# EasyEDA schematic PCB_Schaltplan.json
TITLE: Sheet_1; REV: 1.0; Date: 2023-08-25; Sheet: 1/1; Drawn By: lucaskri; Company: Your Company
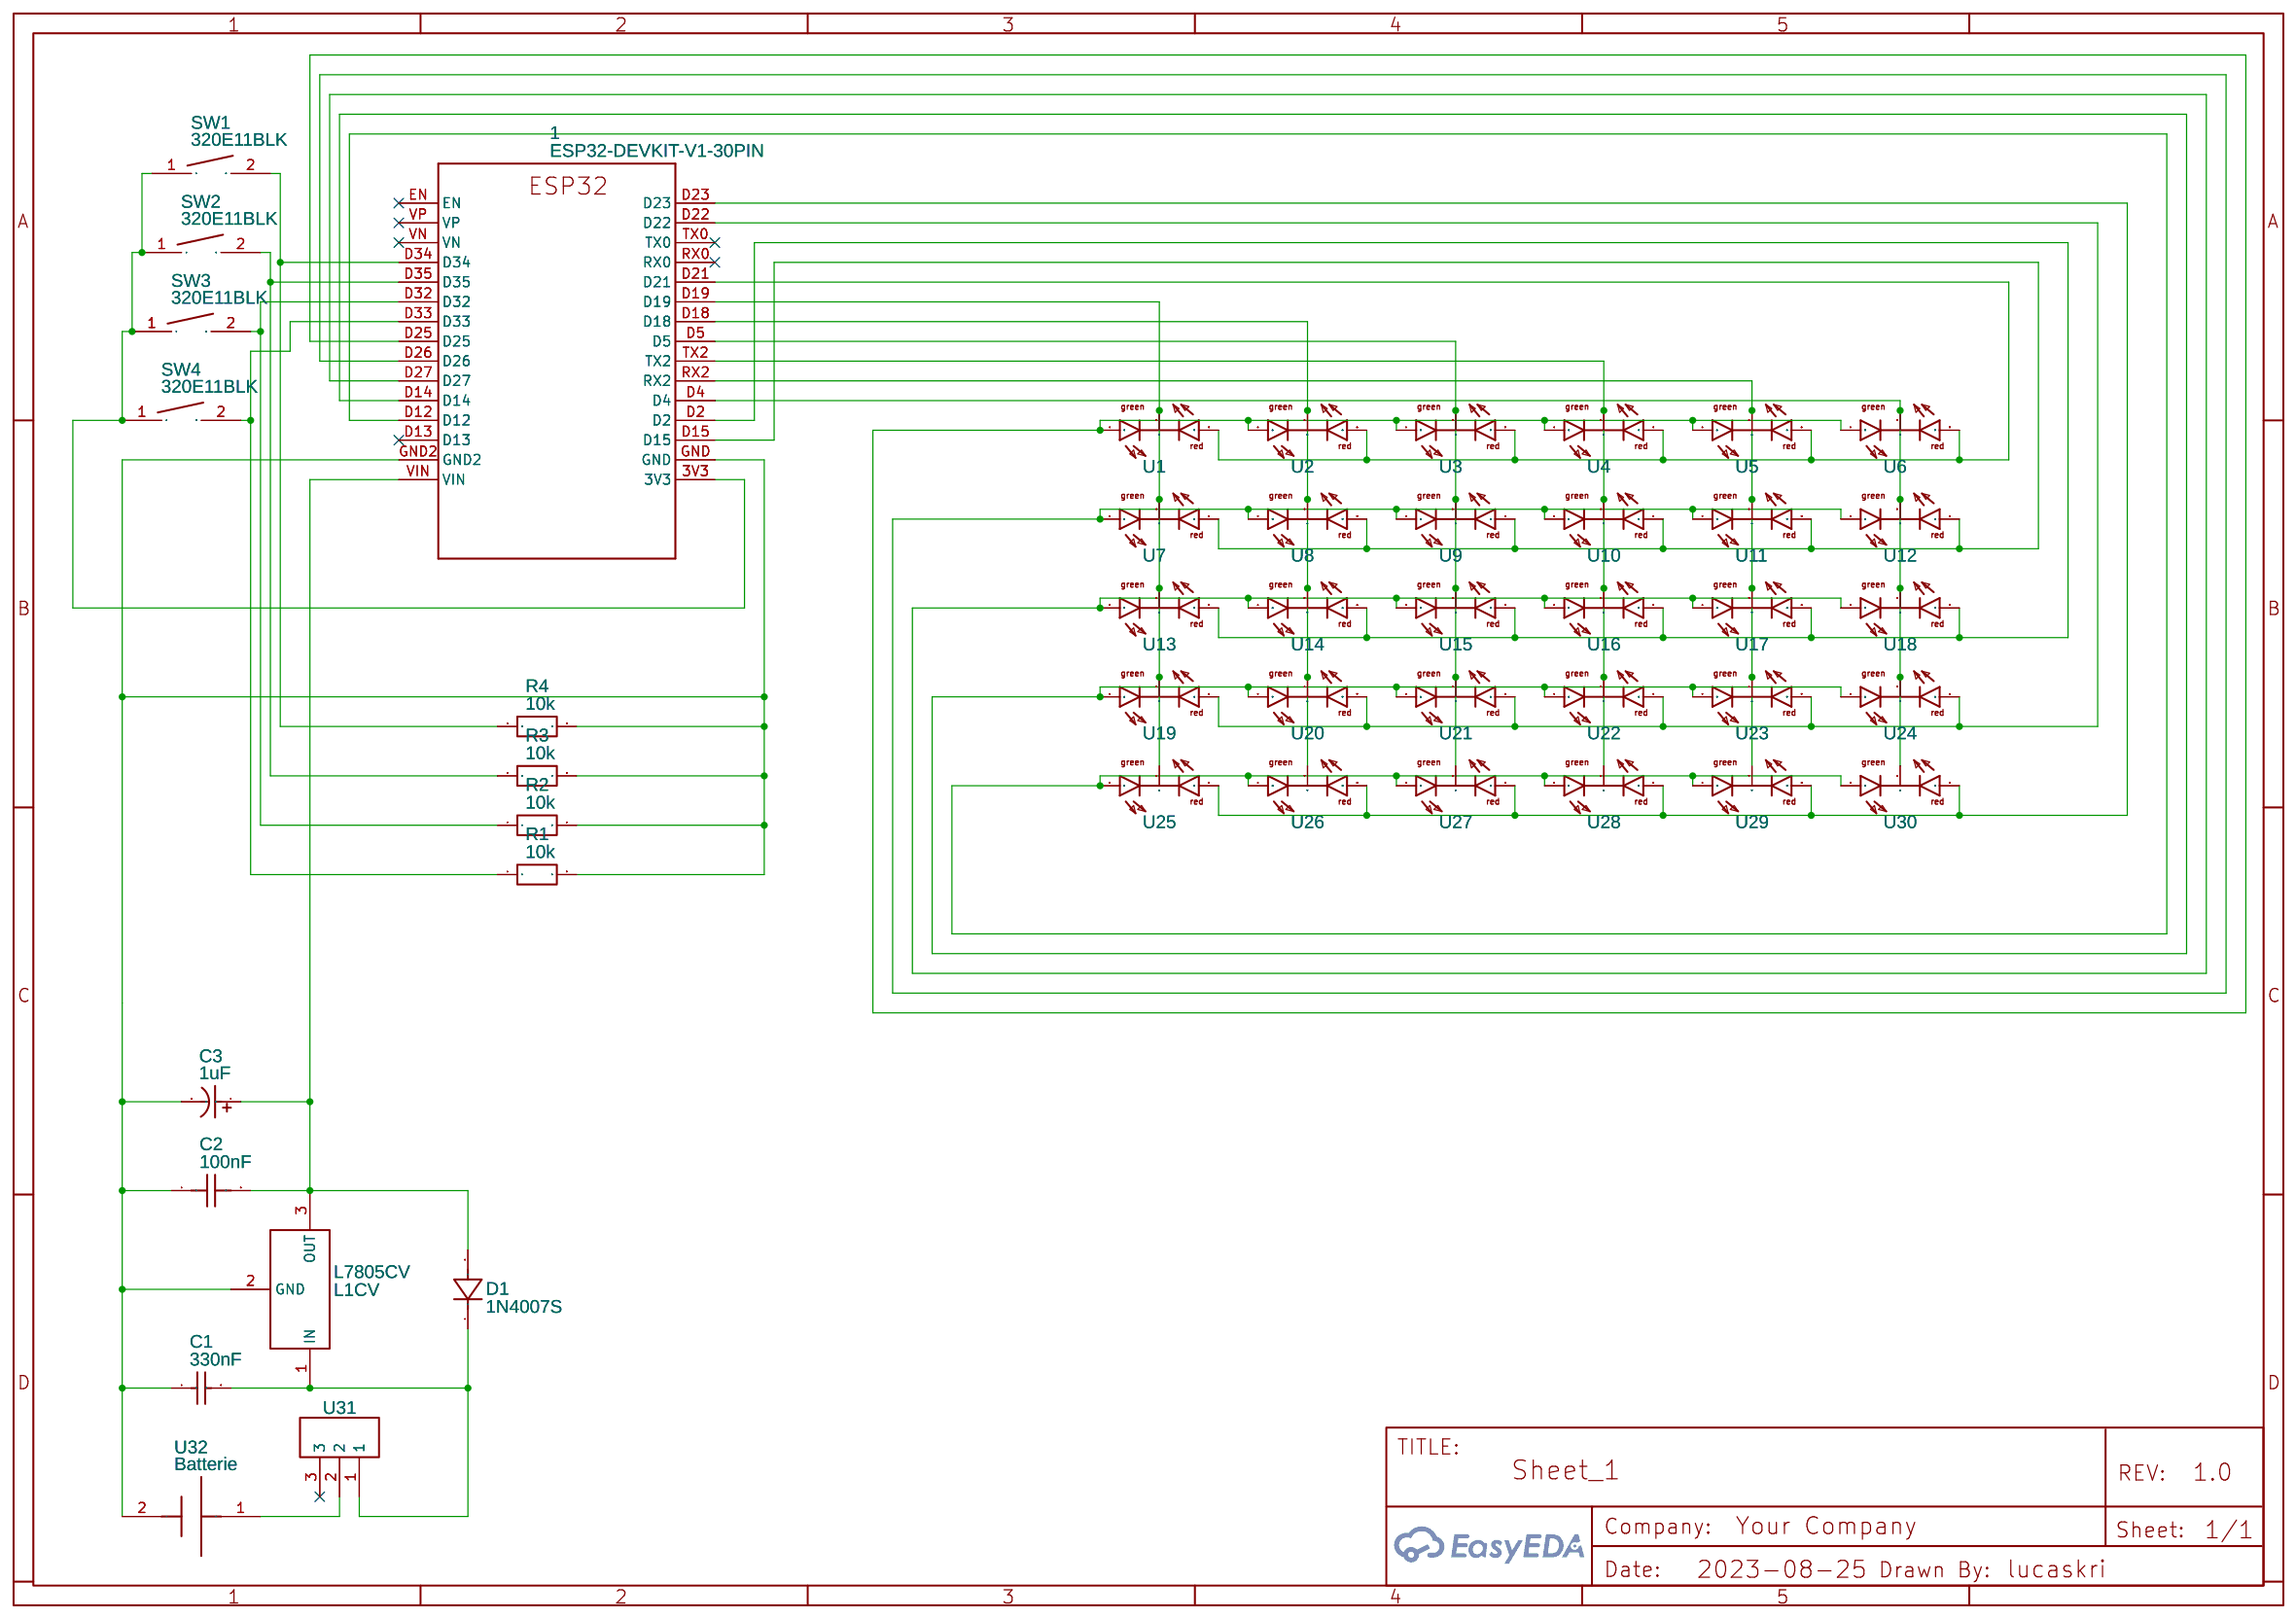
[diagram p0: schematic sheet]

## Parts
1  ESP32-DEVKIT-V1-30PIN  [ESP32-DEVKITV1_ESP32-DEVKITV1]
C1  330nF  [CAP-TH_L8.5-W5.0-P5.00-D1.2]
C2  100nF  [CAP-TH_L7.3-W2.5-P5.00-D0.5]
C3  1uF  [CAP-TH_BD4.0-P1.50-D0.8-FD]
D1  1N4007S  [DO-41_BD2.4-L4.7-P8.70-D0.6-RD]
L1CV  L7805CV  [L7805CV]
R1  10k  [R_AXIAL-0.3]
R2  10k  [R_AXIAL-0.3]
R3  10k  [R_AXIAL-0.3]
R4  10k  [R_AXIAL-0.3]
SW1  320E11BLK  [SW-TH_L12.4-W12.4-P7.18-LS5.08]
SW2  320E11BLK  [SW-TH_L12.4-W12.4-P7.18-LS5.08]
SW3  320E11BLK  [SW-TH_L12.4-W12.4-P7.18-LS5.08]
SW4  320E11BLK  [SW-TH_L12.4-W12.4-P7.18-LS5.08]
U1  NO  [DUOLED-C-5MM]
U2  NO  [DUOLED-C-5MM]
U3  NO  [DUOLED-C-5MM]
U4  NO  [DUOLED-C-5MM]
U5  NO  [DUOLED-C-5MM]
U6  NO  [DUOLED-C-5MM]
U7  NO  [DUOLED-C-5MM]
U8  NO  [DUOLED-C-5MM]
U9  NO  [DUOLED-C-5MM]
U10  NO  [DUOLED-C-5MM]
U11  NO  [DUOLED-C-5MM]
U12  NO  [DUOLED-C-5MM]
U13  NO  [DUOLED-C-5MM]
U14  NO  [DUOLED-C-5MM]
U15  NO  [DUOLED-C-5MM]
U16  NO  [DUOLED-C-5MM]
U17  NO  [DUOLED-C-5MM]
U18  NO  [DUOLED-C-5MM]
U19  NO  [DUOLED-C-5MM]
U20  NO  [DUOLED-C-5MM]
U21  NO  [DUOLED-C-5MM]
U22  NO  [DUOLED-C-5MM]
U23  NO  [DUOLED-C-5MM]
U24  NO  [DUOLED-C-5MM]
U25  NO  [DUOLED-C-5MM]
U26  NO  [DUOLED-C-5MM]
U27  NO  [DUOLED-C-5MM]
U28  NO  [DUOLED-C-5MM]
U29  NO  [DUOLED-C-5MM]
U30  NO  [DUOLED-C-5MM]
U31  NO  [CSS-1201_FOOTPRINT]
U32  Batterie  [BATTERIE]

## Library data of the parts
1 = ESP32-DEVKIT-V1-30PIN: Contributor: u18040382
C1 = CT4-1206Y334M500PF3: Supplier: LCSC; Manufacturer: FH(风华); Supplier Part: C128043; JLCPCB Part Class: Extended Part; link: https://lcsc.com/eda_search?q=C128043&%26type=1&ref=editor
C2 = B32529C0104M289: Contributor: lcsc; Supplier: LCSC; Supplier Part: C3779303; Manufacturer: TDK; link: https://lcsc.com/eda_search?q=C3779303&%26type=1&ref=editor
C3 = 1uF 50V 4*5: Supplier: LCSC; Manufacturer: CX(承兴); Manufacturer Part: KF105M050C05RR0VH2FP0; Supplier Part: C47848; JLCPCB Part Class: Extended Part; link: https://lcsc.com/eda_search?q=C47848&%26type=1&ref=editor
D1 = 1N4007S: Contributor: lcsc; Supplier: LCSC; Supplier Part: C2992088; Manufacturer: 星海; link: https://lcsc.com/eda_search?q=C2992088&%26type=1&ref=editor
L1CV = L7805CV: Supplier: Epcos; Manufacturer: STMicroelectronics; Supplier Part: C111887; Contributor: nickeiffer
R1-R4 = R_AXIAL-0.3_EU: Contributor: LCEDA_Lib
SW1-SW4 = 320E11BLK: Contributor: LCSC; Supplier: LCSC; Supplier Part: C273375; Manufacturer: E-Switch; JLCPCB Part Class: Extended Part; link: https://lcsc.com/eda_search?q=C273375&%26type=1&ref=editor
U1-U30 = DUOLED-RG-C: Contributor: dawodk
U31 = CSS-1201: Supplier: ROBOMECHA; Contributor: mengkuk
U32 = Batterie: Contributor: GMANF1

## Nets
Net-(1-3V3): 1.3V3 SW1.1 SW2.1 SW3.1 SW4.1
Net-(1-D2): 1.D2 U13.AR U14.AR U15.AR U16.AR U17.AR U18.AR
Net-(1-D4): 1.D4 U6.C U12.C U18.C U24.C U30.C
Net-(1-D5): 1.D5 U3.C U9.C U15.C U21.C U27.C
Net-(1-D12): 1.D12 U25.AX(AG) U26.AX(AG) U27.AX(AG) U28.AX(AG) U29.AX(AG) U30.AX(AG)
Net-(1-D14): 1.D14 U19.AX(AG) U20.AX(AG) U21.AX(AG) U22.AX(AG) U23.AX(AG) U24.AX(AG)
Net-(1-D15): 1.D15 U7.AR U8.AR U9.AR U10.AR U11.AR U12.AR
Net-(1-D18): 1.D18 U2.C U8.C U14.C U20.C U26.C
Net-(1-D19): 1.D19 U1.C U7.C U13.C U19.C U25.C
Net-(1-D21): 1.D21 U1.AR U2.AR U3.AR U4.AR U5.AR U6.AR
Net-(1-D22): 1.D22 U19.AR U20.AR U21.AR U22.AR U23.AR U24.AR
Net-(1-D23): 1.D23 U25.AR U26.AR U27.AR U28.AR U29.AR U30.AR
Net-(1-D25): 1.D25 U1.AX(AG) U2.AX(AG) U3.AX(AG) U4.AX(AG) U5.AX(AG) U6.AX(AG)
Net-(1-D26): 1.D26 U7.AX(AG) U8.AX(AG) U9.AX(AG) U10.AX(AG) U11.AX(AG) U12.AX(AG)
Net-(1-D27): 1.D27 U13.AX(AG) U14.AX(AG) U15.AX(AG) U16.AX(AG) U17.AX(AG) U18.AX(AG)
Net-(1-D32): 1.D32 R2.1 SW3.2
Net-(1-D33): 1.D33 R1.1 SW4.2
Net-(1-D34): 1.D34 R4.1 SW1.2
Net-(1-D35): 1.D35 R3.1 SW2.2
Net-(1-GND): 1.GND 1.GND2 C1.1 C2.1 C3.2 L1CV.2(GND) R1.2 R2.2 R3.2 R4.2 U32.2(-)
Net-(1-RX2): 1.RX2 U5.C U11.C U17.C U23.C U29.C
Net-(1-TX2): 1.TX2 U4.C U10.C U16.C U22.C U28.C
Net-(1-VIN): 1.VIN C2.2 C3.1 D1.2(A) L1CV.3(OUT)
Net-(C1-2): C1.2 D1.1(K) L1CV.1(IN) U31.1
Net-(U31-2): U31.2 U32.1(+)

Not connected (* = marked no-connect by the designer): 1 D13* EN* RX0* TX0* VN* VP*; U31 3*
